# Altium schematic sheet STRAIN.SchDoc
size A4; SheetNumber: 2; SheetTotal: 4
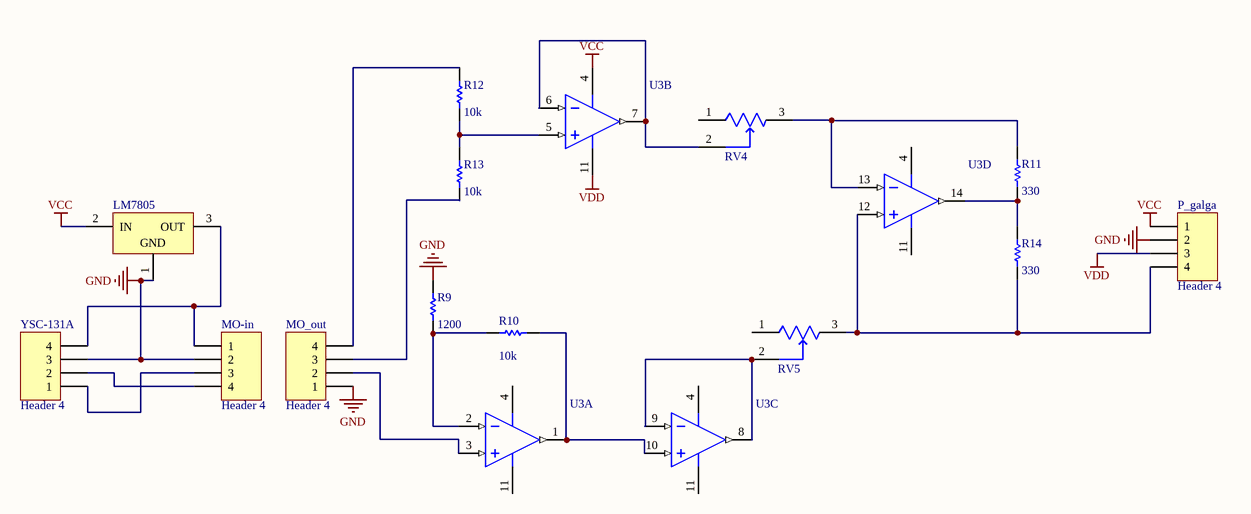
[diagram p0: STRAIN.SchDoc]

## Parts
LM7805  LM7905CT/NOPB  [NDE0003A]  (value not drawn)
MO-in  Header 4  [HDR1X4]
MO_out  Header 4  [HDR1X4]
P_galga  Header 4  [HDR1X4]
R9  value 1200  [AXIAL-0.3]  (hidden comment: Res1)
R10  value 10k  [AXIAL-0.3]  (hidden comment: Res1)
R11  value 330  [AXIAL-0.3]  (hidden comment: Res1)
R12  value 10k  [AXIAL-0.3]  (hidden comment: Res1)
R13  value 10k  [AXIAL-0.3]  (hidden comment: Res1)
R14  value 330  [AXIAL-0.3]  (hidden comment: Res1)
RV4  3296W-1-504LF  [FP-3296W-MFG]  (value not drawn)
RV5  3296W-1-504LF  [FP-3296W-MFG]  (value not drawn)
U3  LF347N  [N0014A]  (value not drawn)  (parts A,B,C,D of 4)
YSC-131A  Header 4  [HDR1X4]

## Nets
GND: LM7805.1(GND) MO-in.2 MO_out.1 P_galga.2 R9.2 YSC-131A.3
VCC: LM7805.2(IN) P_galga.1 U3.4(V+)
VDD: P_galga.3 U3.11(V-)
NetLM7805_3: LM7805.3(OUT) MO-in.1 YSC-131A.4
NetMO-in_3: MO-in.3 YSC-131A.1
NetMO-in_4: MO-in.4 YSC-131A.2
NetMO_out_2: MO_out.2 U3.3(IN1+)
NetMO_out_3: MO_out.3 R13.1
NetMO_out_4: MO_out.4 R12.2
NetP_galga_4: P_galga.4 R14.1 RV5.3(CW) U3.12(IN4+)
NetR9_1: R9.1 R10.1 U3.2(IN1-)
NetR10_2: R10.2 U3.1(OUT1) U3.10(IN3+)
NetR11_1: R11.1 R14.2 U3.14(OUT4)
NetR11_2: R11.2 RV4.3(CW) U3.13(IN4-)
NetR12_1: R12.1 R13.2 U3.5(IN2+)
NetRV4_2: RV4.2(WIPER) U3.6(IN2-) U3.7(OUT2)
NetRV5_2: RV5.2(WIPER) U3.8(OUT3) U3.9(IN3-)

Not connected (* = marked no-connect by the designer): RV4 1(CCW); RV5 1(CCW)

## Library data of the parts
LM7805 = CMP-0062-02481-3: 3-Terminal Negative Regulator, 3-pin TO-220, Pb-Free; Manufacturer: Texas Instruments; PackageTopMarking: NSUZXYTTE#*LM7905CT; CompType: LDO IC; PowerWise: N; PackageDescription: TO-220, Molded, 3 Lead, Straight; ComponentLink1Description: Datasheet URL; ComponentLink1URL: http://www.ti.com/general/docs/lit/getliterature.tsp?genericPartNumber=LM7905&fileType=pdf; PackageReference: NDE0003A; RoHS: Y; PinCount: 3
MO-in MO_out P_galga YSC-131A = Header 4: Header, 4-Pin; LatestRevisionDate: 17-Jul-2002; LatestRevisionNote: Re-released for DXP Platform.; Publisher: Altium Limited
R9-R14 = Res1: Resistor; Published: 8-Jun-2000; LatestRevisionDate: 17-Jul-2002; LatestRevisionNote: Re-released for DXP Platform.; PackageReference: AXIAL-0.3; Publisher: Altium Limited; PackageDescription: Axial Device, Thru-Hole; 2 Leads; 0.3 in Pin Spacing
RV4 RV5 = CMP-2000-05583-2: TRIMMER 500K OHM 0.5W PC PIN TOP; Manufacturer: Bourns; Resistance: 1k; Temperature Coefficient: 100ppm/°C; Value: 725; Tolerance: 10%; Voltage Rating: 300V; Standoff Height: 0.38mm; ComponentLink2Description: Datasheet; Package: 3296W; Series: Trimpot 3296-Sealed; Lead Free: Yes; Octopart: https://octopart.com/3296w-1-504lf-bourns-143884; Device Class L2: Resistors; Automotive: No; RoHS: TRUE; Temperature Range High: +125°C; Manufacturer Part Number: 3296W-1-504LF; Height: 12.05mm; Power Rating: 0.5W; Temperature Range Low: -55°C; ComponentLink2URL: https://www.bourns.com/docs/Product-Datasheets/3296.pdf; Device Class L1: Passive Components; Device Class L3: Variable Resistors and Potentiometers; Category: Res; Temperature: -55°C to +125°C; Digikey Description: TRIMMER 500K OHM 0.5W PC PIN TOP; Mouser Description: Trimmer; Cermet; Rest 500 Kilohms; PCB; 25 Turns; Pwr-Rtg 0.5W
U3 = CMP-0055-00229-3: Wide Bandwidth Quad JFET Input Operational Amplifier, 14-pin MDIP; Manufacturer: Texas Instruments; PowerWise: N; PackageTopMarking: NSUZXYYTTE#*LF347N; CompType: Amplifiers; RoHS: N; PinCount: 14; Package Reference: N0014A; PackageDescription: MDIP, .750 x .250 x.130in, 14 Lead, .100in Pitch; ComponentLink1Description: Datasheet URL; ComponentLink1URL: http://www.ti.com/general/docs/lit/getliterature.tsp?genericPartNumber=LF347&fileType=pdf; Code_JEDEC: MS-001-AA